# EAGLE design timerV2 (EAGLE 6.4)
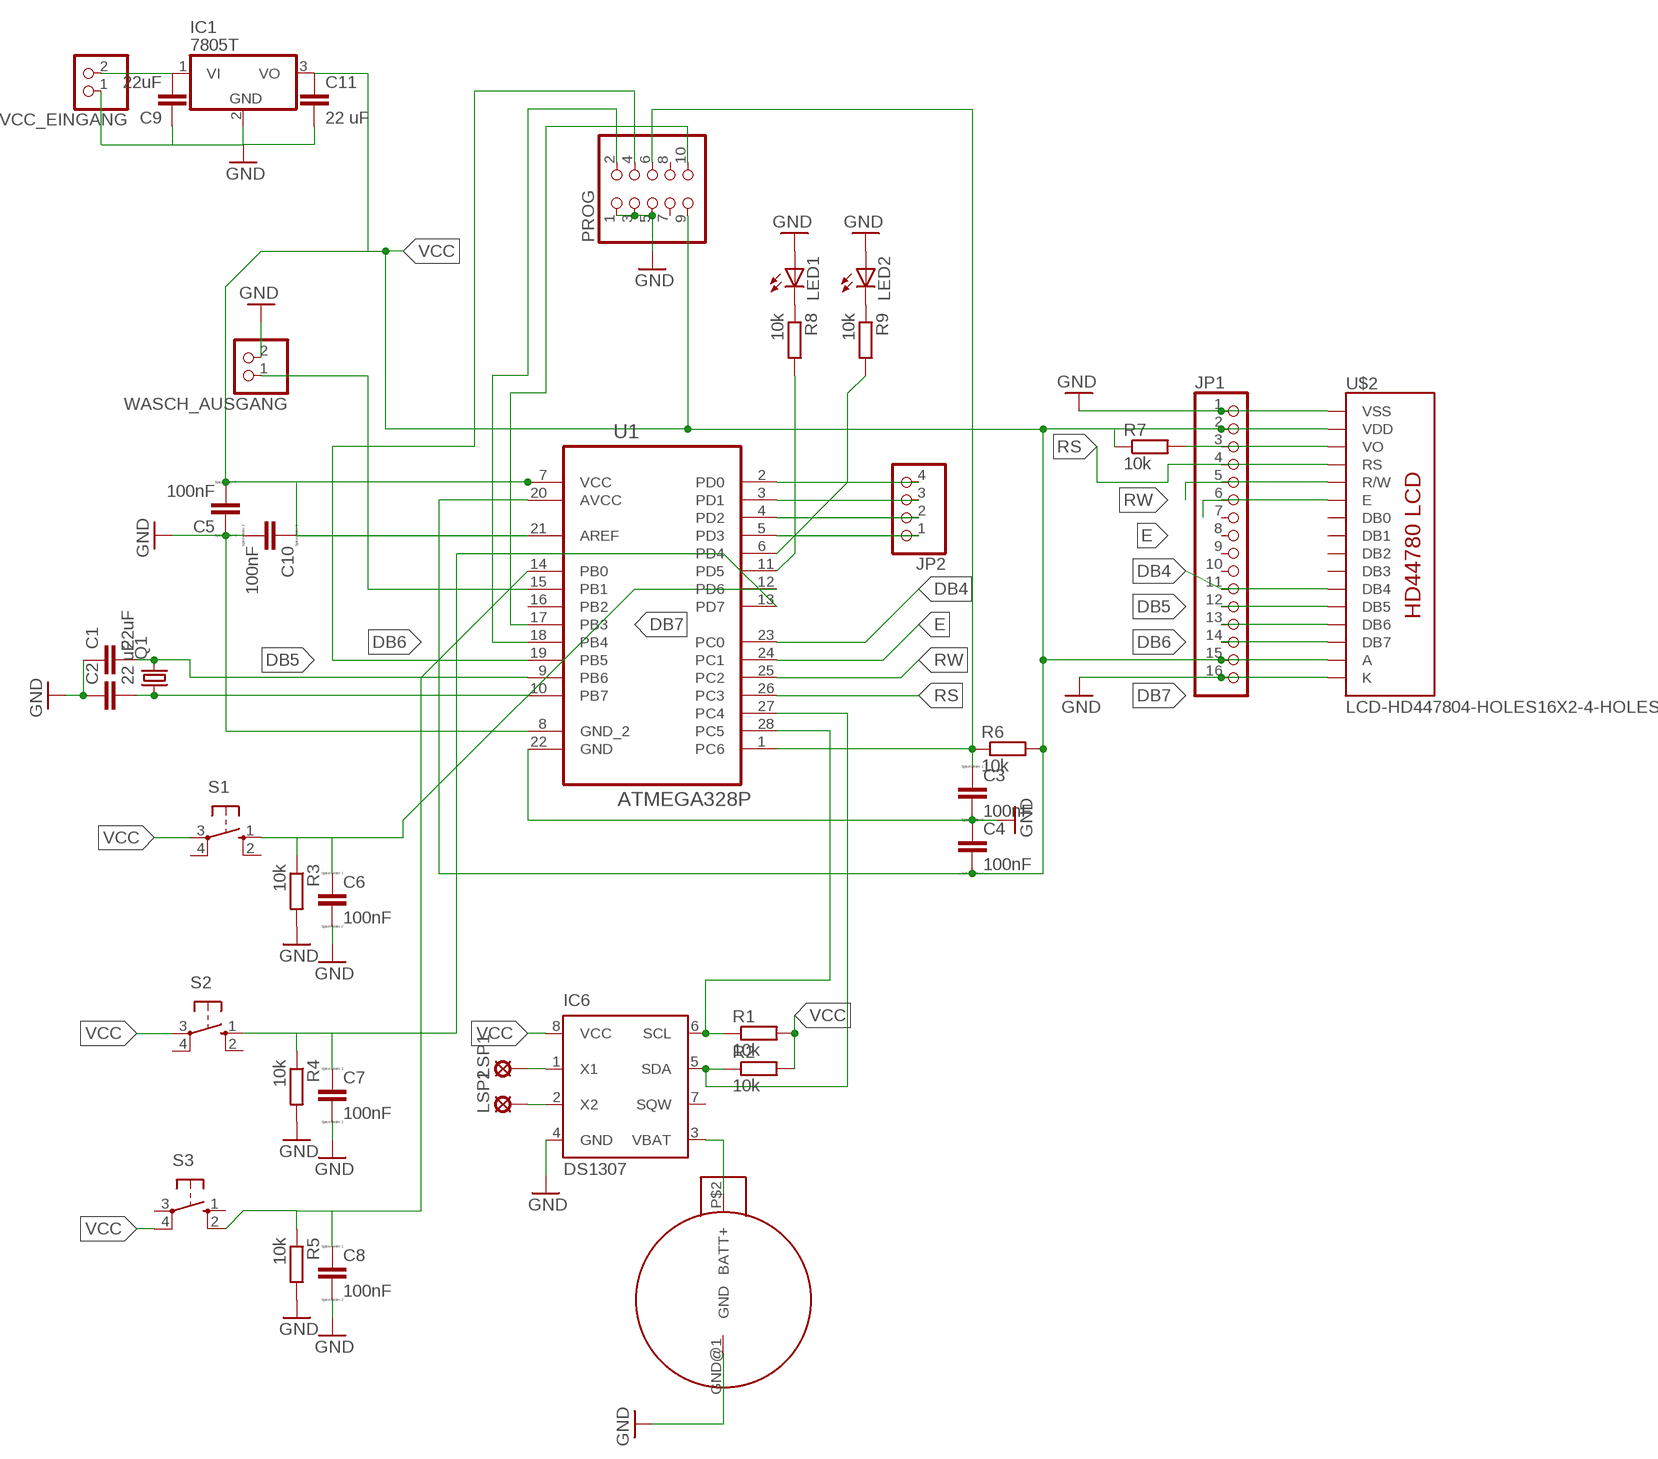
[diagram p0: schematic, sheet 1]

## Parts
C1  22uF  C-EU025-025X050  [C025-025X050]
C2  22 uF  C-EU025-025X050  [C025-025X050]
C3  100nF  CC0603  [C0603]
C4  100nF  CC0603  [C0603]
C5  100nF  CC0603  [C0603]
C6  100nF  CC0603  [C0603]
C7  100nF  CC0603  [C0603]
C8  100nF  CC0603  [C0603]
C9  22uF  C-EU025-025X050  [C025-025X050]
C10  100nF  CC0603  [C0603]
C11  22 uF  C-EU025-025X050  [C025-025X050]
IC1  7805T  [TO220H]
IC6  DS1307  [DIL08]
JP1  PINHD-1X16  [1X16]
JP2  PINHD-1X4/90  [1X04/90]
LED1  LED5MM  [LED5MM]
LED2  LED5MM  [LED5MM]
LSP1  LSP10  [LSP10]
LSP2  LSP10  [LSP10]
PROG  PINHD-2X5  [2X05]
Q1  CRYSTALHC49U-V  [HC49U-V]
R1  10k  R-EU_0204/7  [0204/7]
R2  10k  R-EU_0204/7  [0204/7]
R3  10k  R-EU_0204/7  [0204/7]
R4  10k  R-EU_0204/7  [0204/7]
R5  10k  R-EU_0204/7  [0204/7]
R6  10k  R-EU_0204/7  [0204/7]
R7  10k  R-EU_0204/7  [0204/7]
R8  10k  R-EU_0204/7  [0204/7]
R9  10k  R-EU_0204/7  [0204/7]
S1  10-XX  [B3F-10XX]
S2  10-XX  [B3F-10XX]
S3  10-XX  [B3F-10XX]
U1  ATMEGA328P  ATMEGA328P-PU  [DIP254P762X457-28]
U$1  CR2032  [CR2023]
U$2  LCD-HD447804-HOLES16X2-4-HOLES  [LCD-16X2-4HOLES]
VCC_EINGANG  PINHD-1X2  [1X02]
WASCH_AUSGANG  PINHD-1X2  [1X02]

## Nets
DB4: JP1.11 U1.23(PC0) U$2.11(DB4)
DB5: JP1.12 PROG.4 U1.19(PB5) U$2.12(DB5)
DB6: JP1.13 PROG.2 U1.18(PB4) U$2.13(DB6)
DB7: JP1.14 PROG.10 U1.17(PB3) U$2.14(DB7)
E: JP1.6 U1.24(PC1) U$2.6(E)
GND: C1.1 C2.1 C3.2 C4.1 C5.1 C6.2 C7.2 C8.2 C9.1 C10.2 C11.2 IC1.2(GND) IC6.4(GND) JP1.1 JP1.16 LED1.A LED2.A PROG.1 PROG.3 PROG.5 R3.2 R4.2 R5.2 U1.8(GND_2) U1.22(GND) U$1.GND@1(GND) U$2.1(VSS) U$2.16(K) VCC_EINGANG.1 WASCH_AUSGANG.2
N$1: LED1.K(C) R8.1
N$2: JP1.3 R7.2 U$2.3(VO)
N$3: U1.15(PB1) WASCH_AUSGANG.1
N$4: LED2.K(C) R9.1
N$5: C3.1 PROG.6 R6.1 U1.1(PC6)
N$6: JP2.4 U1.2(PD0)
N$7: C9.2 IC1.1(VI) VCC_EINGANG.2
N$8: C7.1 R4.1 S2.1(S) U1.13(PD7)
N$9: JP2.3 U1.3(PD1)
N$10: JP2.2 U1.4(PD2)
N$11: C8.1 R5.1 S3.2(S1) U1.14(PB0)
N$12: JP2.1 U1.5(PD3)
N$13: R8.2 U1.11(PD5)
N$14: R9.2 U1.6(PD4)
N$20: C6.1 R3.1 S1.1(S) U1.12(PD6)
N$33: IC6.2(X2) LSP2.MP
N$37: IC6.1(X1) LSP1.MP
N$38: IC6.3(VBAT) U$1.P$2(BATT+)
N$39: IC6.6(SCL) R1.1 U1.28(PC5)
N$40: IC6.5(SDA) R2.1 U1.27(PC4)
N$44: C1.2 Q1.2 U1.9(PB6)
N$46: C2.2 Q1.1 U1.10(PB7)
RS: JP1.4 U1.26(PC3) U$2.4(RS)
RW: JP1.5 U1.25(PC2) U$2.5(R/W)
VCC: C4.2 C5.2 C10.1 C11.1 IC1.3(VO) IC6.8(VCC) JP1.2 JP1.15 PROG.9 R1.2 R2.2 R6.2 R7.1 S1.3(P) S2.3(P) S3.4(P1) U1.7(VCC) U1.20(AVCC) U1.21(AREF) U$2.2(VDD) U$2.15(A)
Unconnected: IC6.7(SQW) JP1.7 JP1.8 JP1.9 JP1.10 PROG.7 PROG.8 S1.2(S1) S1.4(P1) S2.2(S1) S2.4(P1) S3.1(S) S3.3(P) U1.16(PB2) U$2.7(DB0) U$2.8(DB1) U$2.9(DB2) U$2.10(DB3)

## Library data of the parts
C1 C2 C9 C11 = resistor:C-EU: CAPACITOR, European symbol
C3-C8 C10 = eagle-ltspice:C: CAPACITOR, European symbol; SPICEMODEL: NONE; SPICEPREFIX: C
IC1 = linear:78*: Positive VOLTAGE REGULATOR Source: http://cache.national.com/ds/LM/LM78L05.pdf http://www.fairchildsemi.com/ds/LM/LM7805.pdf
IC6 = ds1307_pcf8583:DS1307: I2C-Bus CLOCK/CALENDAR
JP1 = pinhead:PINHD-1X16: PIN HEADER
JP2 = pinhead:PINHD-1X4: PIN HEADER
LED1 LED2 = led:LED: LED OSRAM: - CHIPLED LG R971, LG N971, LY N971, LG Q971, LY Q971, LO R971, LY R971 LH N974, LH R974 LS Q976, LO Q976, LY Q976 LO Q996 - Hyper CHIPLED LW Q18S LB Q993, LB Q99A, LB R99A - SideLED LS A670, LO A670, LY A670, LG A670, LP A670 LB A673, LV A673, LT A673, LW A673 LH A674 LY A675 LS A676, LA A676, LO A676, LY A676, LW A676 LS A679, LY A679, LG A679 - Hyper Micro SIDELED® LS Y876, LA Y876, LO Y876, LY Y876 LT Y87S - SmartLED LW L88C, LW L88S LB L89C, LB L89S, LG L890 LS L89K, LO L89K, LY L89K LS L896, LA L896, LO L896, LY L896 - TOPLED LS T670, LO T670, LY T670, LG T670, LP T670 LSG T670, LSP T670, LSY T670, LOP T670, LYG T670 LG T671, LOG T671, LSG T671 LB T673, LV T673, LT T673, LW T673 LH T674 LS T676, LA T676, LO T676, LY T676, LB T676, LH T676, LSB T676, LW T676 LB T67C, LV T67C, LT T67C, LS T67K, LO T67K, LY T67K, LW E67C LS E67B, LA E67B, LO E67B, LY E67B, LB E67C, LV E67C, LT E67C LW T67C LS T679, LY T679, LG T679 LS T770, LO T770, LY T770, LG T770, LP T770 LB T773, LV T773, LT T773, LW T773 LH T774 LS E675, LA E675, LY E675, LS T675 LS T776, LA T776, LO T776, LY T776, LB T776 LHGB T686 LT T68C, LB T68C - Hyper Mini TOPLED® LB M676 - Mini TOPLED Santana® LG M470 LS M47K, LO M47K, LY M47K Source: http://www.osram.convergy.de LUXEON: - LUMILED® LXK2-PW12-R00, LXK2-PW12-S00, LXK2-PW14-U00, LXK2-PW14-V00 LXK2-PM12-R00, LXK2-PM12-S00, LXK2-PM14-U00 LXK2-PE12-Q00, LXK2-PE12-R00, LXK2-PE12-S00, LXK2-PE14-T00, LXK2-PE14-U00 LXK2-PB12-K00, LXK2-PB12-L00, LXK2-PB12-M00, LXK2-PB14-N00, LXK2-PB14-P00, LXK2-PB14-Q00 LXK2-PR12-L00, LXK2-PR12-M00, LXK2-PR14-Q00, LXK2-PR14-R00 LXK2-PD12-Q00, LXK2-PD12-R00, LXK2-PD12-S00 LXK2-PH12-R00, LXK2-PH12-S00 LXK2-PL12-P00, LXK2-PL12-Q00, LXK2-PL12-R00 Source: www.luxeon.com KINGBRIGHT: KA-3528ASYC Source: www.kingbright.com
LSP1 LSP2 = solpad:LSP10: SOLDER PAD drill 1.0 mm, distributor Buerklin, 12H555
PROG = pinhead:PINHD-2X5: PIN HEADER
Q1 = crystal:CRYSTAL: CRYSTAL; OC_FARNELL: 1666969; OC_NEWARK: unknown
R1-R9 = resistor:R-EU_: RESISTOR, European symbol
S1-S3 = switch-omron:10-XX: OMRON SWITCH; MPN: B3F-1000; OC_FARNELL: 176432; OC_NEWARK: 36M3542
U1 = Atmel_By_element14_Batch_1:ATMEGA328P-PU: 8-bit Microcontroller with In-System Programmable Flash; MPN: ATMEGA328P-PU; OC_FARNELL: 1715487; OC_NEWARK: 15R0268; PACKAGE: PDIP-28; SUPPLIER: Atmel
U$1 = 2032:CR2032
U$2 = HD44780LCD:LCD-HD44780
VCC_EINGANG WASCH_AUSGANG = pinhead:PINHD-1X2: PIN HEADER

## Net classes
0 default: width 0.381 mm, drill 0.508 mm, clearance 0.254 mm

## Board
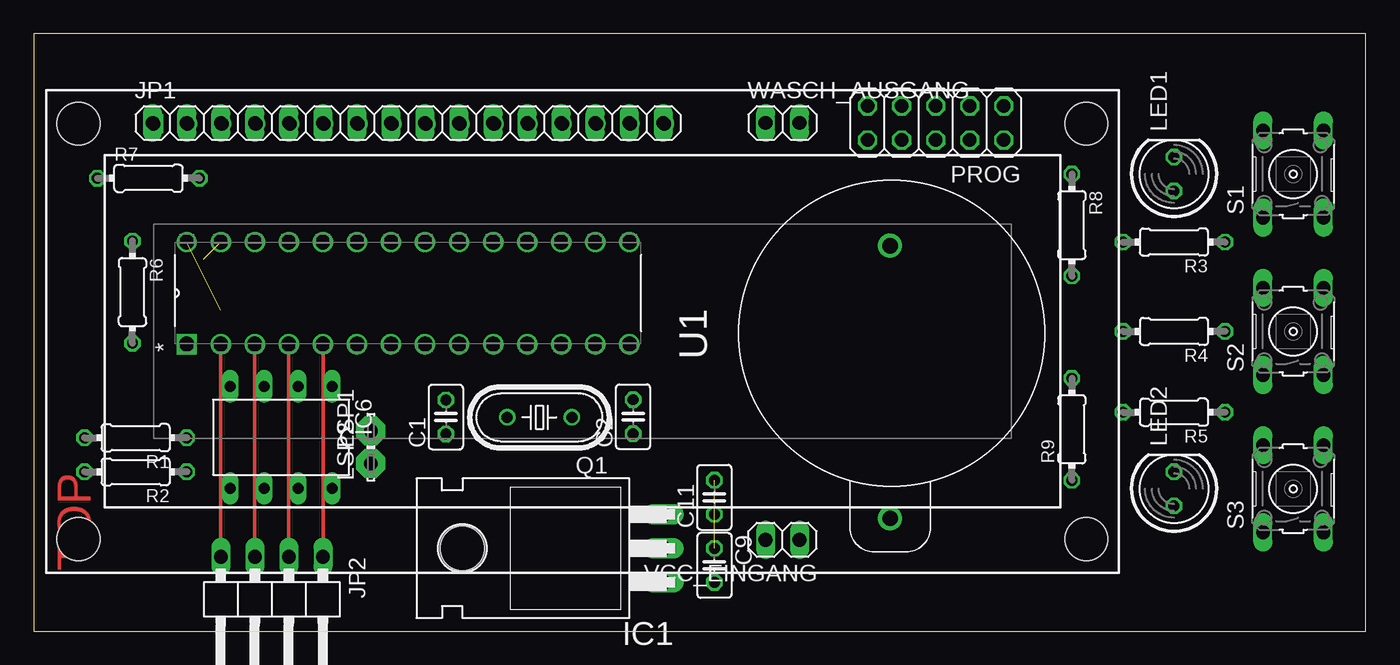
[diagram p1: board, top side]
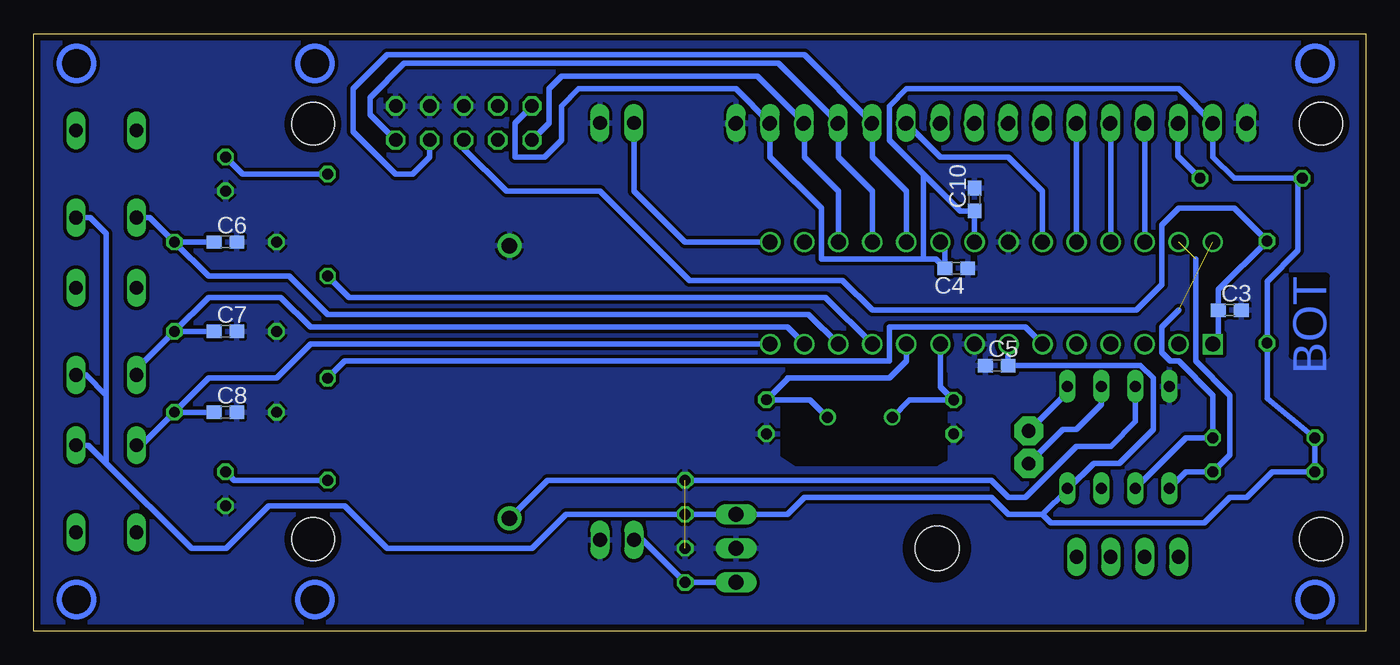
[diagram p2: board, bottom side, seen from below]

Size 99.41 x 44.6 mm. Coordinates in mm from the lower left corner, seen from the top.
Outline: 99.41,0 99.41,44.6 0,44.6 0,0 99.41,0
Copper layers (1*16): Top 0.035mm / dielectric 1.5mm / Bottom 0.035mm
Design rules "multi-cb_035um-cu *": minimum track width 6mil, minimum drill 12mil, track to track 6mil, track to pad 6mil, pad to pad 6mil, via to via 6mil, smd to smd 6mil, copper to edge 20mil, drill to drill 8mil, minimum pad ring 8mil, minimum via ring 6mil, stop-mask expansion 3mil, vias tented up to drill 0mil, thermal gap 8mil
bRestrict: area 31.4,12.5 to 43.5,19.5

### Footprints (pad centres in the part's own frame; a part is rotated, then mirrored left to right if it is on the bottom)
C025-025X050 = drill 0.813 octagon: 1 -1.27,0; 2 1.27,0
C0603 = smd 1.1 x 1: 1 -0.85,0; 2 0.85,0
TO220H = drill 1.118 long: 1 -2.54,-10.16; 2 0,-10.16; 3 2.54,-10.16 | hole 3.302: 0,4.826
DIL08 = drill 0.813 long: 1 -3.81,-3.81; 2 -1.27,-3.81; 3 1.27,-3.81; 4 3.81,-3.81; 5 3.81,3.81; 6 1.27,3.81; 7 -1.27,3.81; 8 -3.81,3.81
1X16 = drill 1.016 long: 1 -19.05,0; 2 -16.51,0; 3 -13.97,0; 4 -11.43,0; 5 -8.89,0; 6 -6.35,0; 7 -3.81,0; 8 -1.27,0; 9 1.27,0; 10 3.81,0; 11 6.35,0; 12 8.89,0; 13 11.43,0; 14 13.97,0; 15 16.51,0; 16 19.05,0
1X04/90 = drill 1.016 long: 1 -3.81,-3.81; 2 -1.27,-3.81; 3 1.27,-3.81; 4 3.81,-3.81
LED5MM = drill 0.813 octagon: A -1.27,0; K 1.27,0
LSP10 = drill 1.016 pad 2.159 octagon: MP 0,0
2X05 = drill 1.016 octagon: 1 -5.08,-1.27; 2 -5.08,1.27; 3 -2.54,-1.27; 4 -2.54,1.27; 5 0,-1.27; 6 0,1.27; 7 2.54,-1.27; 8 2.54,1.27; 9 5.08,-1.27; 10 5.08,1.27
HC49U-V = drill 0.813: 1 -2.413,0; 2 2.413,0
0204/7 = drill 0.813 octagon: 1 -3.81,0; 2 3.81,0
B3F-10XX = drill 1.016 long: 1 -3.251,2.261; 2 3.251,2.261; 3 -3.251,-2.261; 4 3.251,-2.261
DIP254P762X457-28 = drill 1.118 square: 1 -7.62,33.02 | drill 1.118: 2 -7.62,30.48; 3 -7.62,27.94; 4 -7.62,25.4; 5 -7.62,22.86; 6 -7.62,20.32; 7 -7.62,17.78; 8 -7.62,15.24; 9 -7.62,12.7; 10 -7.62,10.16; 11 -7.62,7.62; 12 -7.62,5.08; 13 -7.62,2.54; 14 -7.62,0; 15 0,0; 16 0,2.54; 17 0,5.08; 18 0,7.62; 19 0,10.16; 20 0,12.7; 21 0,15.24; 22 0,17.78; 23 0,20.32; 24 0,22.86; 25 0,25.4; 26 0,27.94; 27 0,30.48; 28 0,33.02
CR2023 = drill 1.143 pad 1.778: GND@1 0,5.35; P$2 0,-15
LCD-16X2-4HOLES = drill 1.016 square: 1 -32,15.5 | drill 1.016: 2 -29.46,15.5; 3 -26.92,15.5; 4 -24.38,15.5; 5 -21.84,15.5; 6 -19.3,15.5; 7 -16.76,15.5; 8 -14.22,15.5; 9 -11.68,15.5; 10 -9.14,15.5; 11 -6.6,15.5; 12 -4.06,15.5; 13 -1.52,15.5; 14 1.02,15.5; 15 3.56,15.5; 16 6.1,15.5 | hole 3.2: -37.6,15.5; -37.6,-15.5; 37.6,-15.5; 37.6,15.5
1X02 = drill 1.016 long: 1 -1.27,0; 2 1.27,0

### Placement (x,y rotation side)
C1  30.76,15.98 90 top
C2  44.73,16 90 top
C3  10.16,23.95 0 bottom
C4  30.56,27.08 180 bottom
C5  27.55,19.82 0 bottom
C6  85.09,29.04 0 bottom
C7  85.09,22.37 0 bottom
C8  85.09,16.34 0 bottom
C9  50.8,4.91 270 top
C10  29.21,32.21 90 bottom
C11  50.8,9.98 90 top
IC1  36.83,6.17 90 top
IC6  18.48,14.46 180 top
JP1  27.94,37.93 0 top
JP2  17.78,1.73 180 top
LED1  85.09,34.12 90 top
LED2  85.09,10.62 90 top
LSP1  25.16,14.94 90 top
LSP2  25.16,12.51 90 top
PROG  67.31,37.93 180 top
Q1  37.75,15.95 180 top
R1  7.62,14.43 180 top
R2  7.62,11.89 180 top
R3  85.09,29.04 180 top
R4  85.09,22.37 180 top
R5  85.09,16.34 180 top
R6  7.38,25.3 270 top
R7  8.57,33.8 0 top
R8  77.47,30.3 270 top
R9  77.47,15.06 90 top
S1  93.98,34.12 90 top
S2  93.98,22.37 90 top
S3  93.98,10.62 90 top
U1  44.45,29.04 90 top
U$1  63.91,23.41 0 top
U$2  40.96,22.37 0 top
VCC_EINGANG  55.88,6.81 180 top
WASCH_AUSGANG  55.88,37.93 0 top

### Tracks (layer width: path | path; a pad name or v marks a point on that pad's centre or on a via)
DB4
  Bottom 0.406: U1.23 24.13,32.85 26.67,35.39 31.75,35.39 JP1.11 U$2.11
DB5
  Bottom 0.406: JP1.12 36.83,35.39 34.29,32.85 U1.19 | JP1.12 41.91,43.01 73.03,43.01 75.56,40.47 75.56,37.29 72.39,34.12 71.12,34.12 69.85,35.39 PROG.4 | U$2.12 36.89,37.87 JP1.12
DB6
  Bottom 0.406: JP1.13 39.37,35.39 36.83,32.85 U1.18 | PROG.2 74.3,38.56 74.3,39.83 71.76,42.37 43.81,42.37 JP1.13 | JP1.13 U$2.13
DB7
  Bottom 0.406: JP1.14 45.4,41.42 60.01,41.42 60.96,40.47 60.96,37.93 PROG.10 | JP1.14 U$2.14 | U1.17 39.37,32.85 41.91,35.39 JP1.14
E
  Bottom 0.406: U1.24 JP1.6 21.65,37.87 U$2.6
GND  (1 unrouted)
  pour Bottom: 101.6,45.55 -4.08,45.12 -0.7,-0.99 101.6,-1.36
N$1
  Bottom 0.406: LED1.K 83.82,34.12 R8.1
N$2
  Bottom 0.406: JP1.3 14.03,37.87 U$2.3 14.04,35.45 R7.2
N$3
  Bottom 0.406: WASCH_AUSGANG.1 54.61,32.85 50.8,29.04 U1.15
N$4
  Bottom 0.406: LED2.K 84.45,11.25 R9.1
N$5
  Bottom 0.406: U1.1 11.01,21.84 C3.1 11.01,25.48 R6.1 9.84,31.57 13.97,31.57 15.24,30.3 15.24,25.86 17.14,23.95 36.83,23.95 39.05,26.18 50.48,26.18 57.15,32.85 64.14,32.85 67.31,36.02 PROG.6
N$6
  Top 0.254: U1.2 JP2.4
N$7
  Bottom 0.406: IC1.1 C9.2 53.97,6.81 VCC_EINGANG.2
N$8
  Bottom 0.406: U1.13 43.18,22.68 78.74,22.68 80.96,24.91 86.36,24.91 R4.1 | C7.1 R4.1 | S2.1 91.72,19.55 R4.1
N$9
  Top 0.254: U1.3 JP2.3
N$10
  Top 0.254: U1.4 JP2.2
N$11
  Bottom 0.406: U1.14 78.74,21.41 81.28,18.88 86.36,18.88 R5.1 | R5.1 C8.1 | S3.2 91.36,13.87 R5.1
N$12
  Top 0.254: U1.5 JP2.1
N$13
  Bottom 0.406: U1.11 40.32,24.91 75.88,24.91 R8.2
N$14
  Bottom 0.406: U1.6 25.4,22.68 35.56,22.68 35.56,20.14 76.2,20.14 R9.2
N$20
  Bottom 0.406: U1.12 41.59,23.64 77.47,23.64 80.33,26.5 86.36,26.5 R3.1 | C6.1 R3.1 | S1.1 90.73,30.86 R3.1
N$33
  Bottom 0.406: IC6.2 19.75,16.9 21.59,15.06 22.61,15.06 LSP2.MP
N$37
  Bottom 0.406: IC6.1 22.29,17.81 LSP1.MP
N$38
  Bottom 0.406: IC6.3 17.21,15.63 19.05,13.79 21.59,13.79 25.4,9.98 26.67,9.98 27.94,11.25 61.07,11.25 U$1.P$2
N$39  (1 unrouted)
  Bottom 0.406: 13.97,23.95 15.24,22.68 15.24,20.78 14.61,20.14 13.97,20.14 11.43,17.61 R1.1 13.43,14.43 IC6.6
N$40  (1 unrouted)
  Bottom 0.406: 12.7,27.77 12.7,20.14 10.16,17.61 10.16,13.16 R2.1 13.43,11.89 IC6.5
N$44
  Bottom 0.406: Q1.2 34.04,17.25 C1.2 31.75,18.23 U1.9
N$46
  Bottom 0.406: Q1.1 41.48,17.27 C2.2 43.18,18.82 43.18,18.88 35.56,18.88 34.29,20.14 U1.10
RS
  Bottom 0.406: U1.26 JP1.4 16.57,37.87 U$2.4
RW
  Bottom 0.406: U1.25 JP1.5 19.11,37.87 U$2.5
VCC
  Bottom 0.406: 93.98,17.61 93.98,29.67 95.17,30.86 S1.3 | U1.7 C5.2 26.63,19.83 16.83,19.83 15.88,18.88 15.88,15.06 18.41,12.52 20.32,12.52 22.2,10.65 IC6.8 22.29,10.55 24.13,8.71 | U$2.15 44.51,37.87 JP1.15 | JP1.15 44.45,35.39 40.64,31.57 40.64,27.77 33.02,27.77 | PROG.9 63.5,37.93 63.5,35.39 61.28,35.39 60.01,36.66 60.01,39.2 58.74,40.47 46.99,40.47 JP1.15 | U1.20 31.41,28.7 C4.2 32.09,27.77 33.02,27.77 | 33.02,34.12 35.56,36.66 35.56,39.2 34.29,40.47 13.97,40.47 JP1.2 11.49,37.87 U$2.2 11.43,37.8 11.43,35.39 9.84,33.8 R7.1 5.08,33.48 5.08,28.4 7.38,26.1 R6.2 7.38,17.36 R1.2 R2.2 6.99,11.89 8.89,9.98 10.16,9.98 12.07,8.08 23.5,8.08 24.13,8.71 | 33.02,34.12 33.02,27.77 | S2.3 95.49,19.12 93.98,17.61 | 93.98,12.52 93.98,17.61 | S3.4 95.33,13.87 93.98,12.52 | C11.1 59.69,8.71 62.23,6.17 73.03,6.17 76.2,9.35 81.86,9.35 85.04,6.17 87.63,6.17 93.98,12.52 | IC1.3 C11.1 | C11.1 43.18,8.71 41.91,9.98 27.94,9.98 26.67,8.71 24.13,8.71 | U1.21 C10.1 30.27,31.36 33.02,34.12
(copper drawn outside any net)
  shapes: Bottom circle x6

### Text on the board
Top: TOP
Bottom: BOT